# Altium schematic sheet sram_rom_old.SchDoc: SoPC Oscilloscope - SRAM, ROM
size A; DrawnBy: Santiago Navonne; Revision: 1.0; SheetNumber: 2; SheetTotal: 5
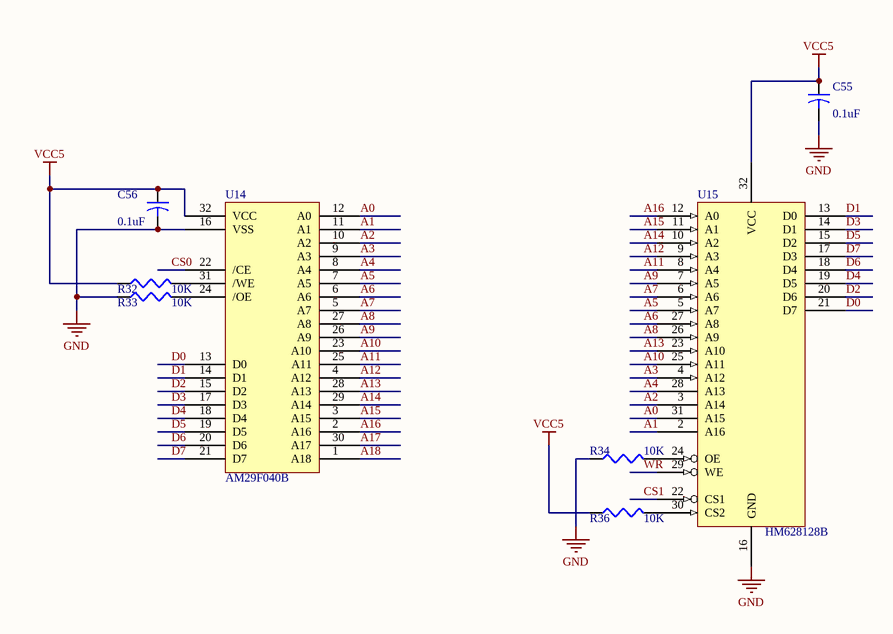
[diagram p0: sram_rom_old.SchDoc]

## Parts
C55  value 0.1uF  [CAPC1608L]  (hidden comment: Cap2)
C56  value 0.1uF  [CAPC1608L]  (hidden comment: Cap2)
R32  value 10K  [RESC1608N]  (hidden comment: Res3)
R33  value 10K  [RESC1608N]  (hidden comment: Res3)
R34  value 10K  [RESC1608N]  (hidden comment: Res3)
R36  value 10K  [RESC1608N]  (hidden comment: Res3)
U14  AM29F040B  [PLCCS32]
U15  HM628128B  [DIP32]

## Nets
GND: C55.2 C56.2 R33.1 R34.1 U14.16(VSS) U15.16(GND)
VCC: C55.1 C56.1 R32.1 R36.1 U14.32(VCC) U15.32(VCC)  [also labelled VCC5]
A0: U14.12(A0) U15.31(A15)
A1: U14.11(A1) U15.2(A16)
A2: U14.10(A2) U15.3(A14)
A3: U14.9(A3) U15.4(A12)
A4: U14.8(A4) U15.28(A13)
A5: U14.7(A5) U15.5(A7)
A6: U14.6(A6) U15.27(A8)
A7: U14.5(A7) U15.6(A6)
A8: U14.27(A8) U15.26(A9)
A9: U14.26(A9) U15.7(A5)
A10: U14.23(A10) U15.25(A11)
A11: U14.25(A11) U15.8(A4)
A12: U14.4(A12) U15.9(A3)
A13: U14.28(A13) U15.23(A10)
A14: U14.29(A14) U15.10(A2)
A15: U14.3(A15) U15.11(A1)
A16: U14.2(A16) U15.12(A0)
A17: U14.30(A17)
A18: U14.1(A18)
CS0: U14.22(/CE)
CS1: U15.22(CS1)
D0: U14.13(D0) U15.21(D7)
D1: U14.14(D1) U15.13(D0)
D2: U14.15(D2) U15.20(D6)
D3: U14.17(D3) U15.14(D1)
D4: U14.18(D4) U15.19(D5)
D5: U14.19(D5) U15.15(D2)
D6: U14.20(D6) U15.18(D4)
D7: U14.21(D7) U15.17(D3)
WR: U15.29(WE)
NetR32_2: R32.2 U14.31(/WE)
NetR33_2: R33.2 U14.24(/OE)
NetR34_2: R34.2 U15.24(OE)
NetR36_2: R36.2 U15.30(CS2)

## Library data of the parts
C55 C56 = Cap2: Capacitor; Published: 23-Sep-2002; PackageReference: CAPR5-4X5; Publisher: Altium Limited; PackageDescription: Capacitor; 2 Leads
R32-R34 R36 = Res3: Resistor; Published: 8-Jun-2000; LatestRevisionDate: 29-May-2009; LatestRevisionNote: IPC-7351 Footprint Added.; PackageReference: J1-0603; Publisher: Altium Limited; PackageDescription: Chip Resistor
U14 = AM29F040B: 512KBit x 8 ROM
U15 = HM628128B: 1 M SRAM (128-kword x 8-bit)